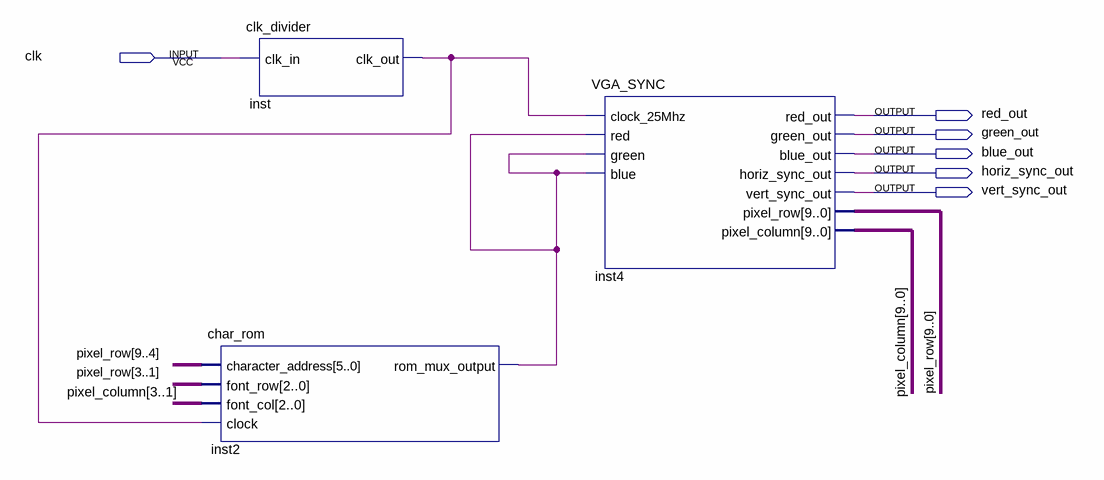
[diagram p0: schematic sheet]
// Quartus schematic Block_letters.bdf as structural Verilog: 3 symbols, 6 pins
module Block_letters (
  input  clk,
  output red_out,
  output green_out,
  output blue_out,
  output horiz_sync_out,
  output vert_sync_out
);

  wire inst2_rom_mux_output, inst_clk_out;
  wire [9:0] pixel_column, pixel_row;

  char_rom inst2 (
    .character_address(pixel_row[9:4]), .font_row(pixel_row[3:1]), .font_col(pixel_column[3:1]),
    .clock(inst_clk_out), .rom_mux_output(inst2_rom_mux_output));
  clk_divider inst (.clk_in(clk), .clk_out(inst_clk_out));
  VGA_SYNC inst4 (
    .clock_25Mhz(inst_clk_out), .red(inst2_rom_mux_output), .green(inst2_rom_mux_output),
    .blue(inst2_rom_mux_output), .red_out(red_out), .green_out(green_out), .blue_out(blue_out),
    .horiz_sync_out(horiz_sync_out), .vert_sync_out(vert_sync_out), .pixel_row(pixel_row),
    .pixel_column(pixel_column));
endmodule
